# EAGLE schematic Wheel_Test_Signal (EAGLE 9.6.2)
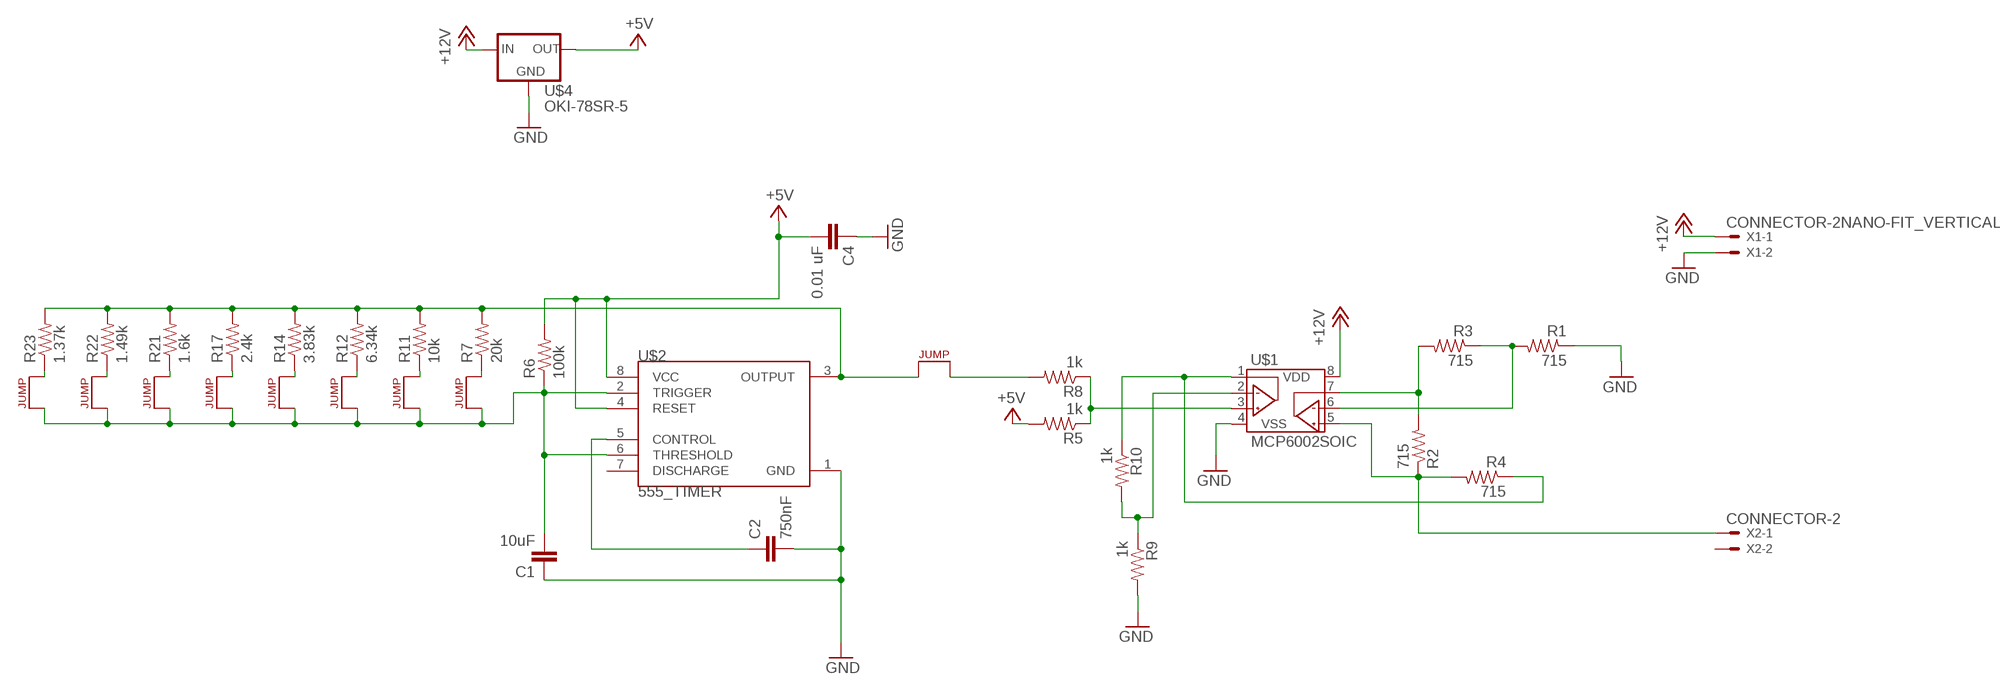
[diagram p0: schematic, sheet 1, part 1 of 2]
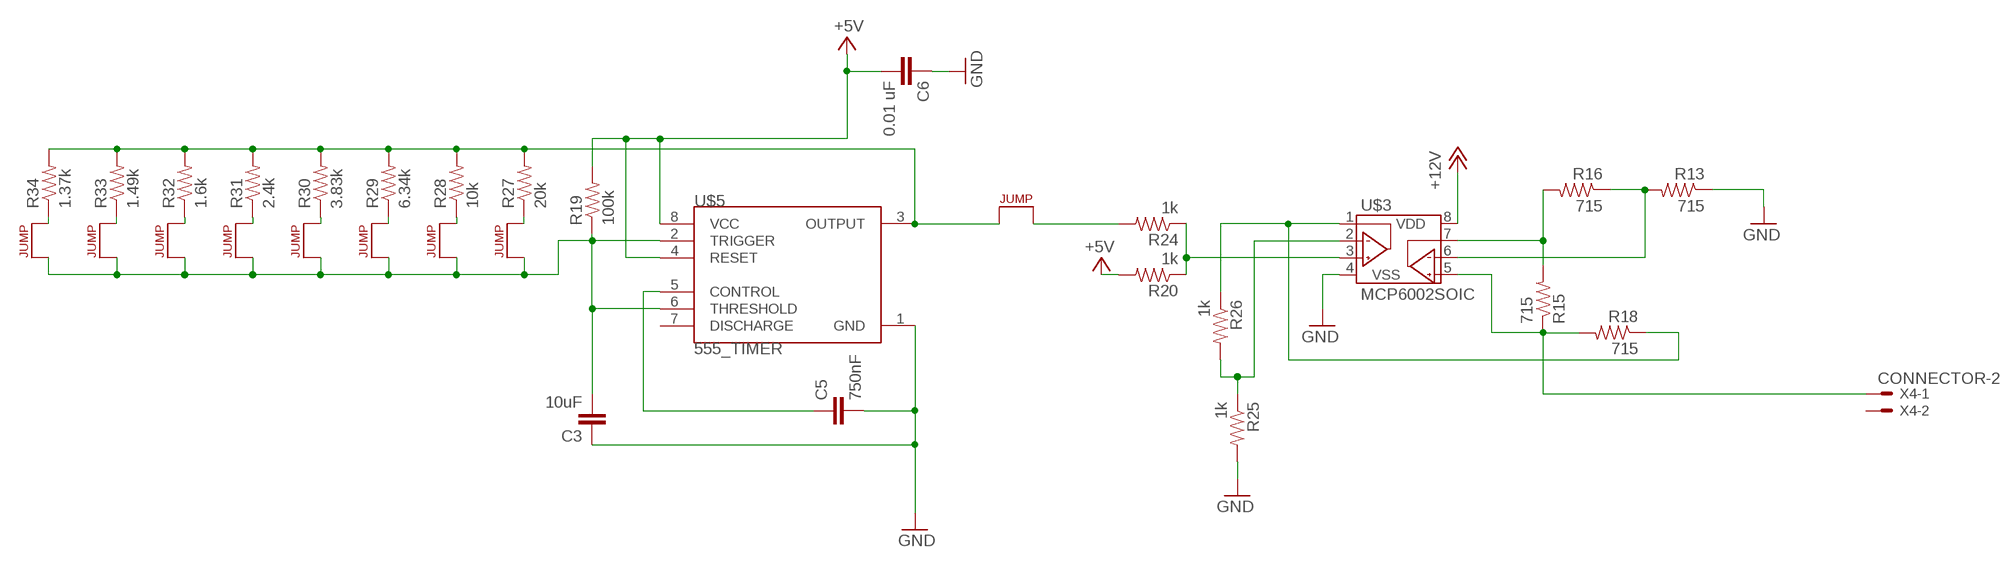
[diagram p1: schematic, sheet 1, part 2 of 2]

## Parts
C1  10uF  CAP0603-CAP  [0603-CAP]
C2  750nF  CAP0603-CAP  [0603-CAP]
C3  10uF  CAP0603-CAP  [0603-CAP]
C4  0.01 uF  CAP0603-CAP  [0603-CAP]
C5  750nF  CAP0603-CAP  [0603-CAP]
C6  0.01 uF  CAP0603-CAP  [0603-CAP]
J1  JUMPER.1  [1X02]
J2  JUMPER.1  [1X02]
J3  JUMPER.1  [1X02]
J4  JUMPER.1  [1X02]
J5  JUMPER.1  [1X02]
J6  JUMPER.1  [1X02]
J7  JUMPER.1  [1X02]
J8  JUMPER.1  [1X02]
J9  JUMPER.1  [1X02]
J10  JUMPER.1  [1X02]
J11  JUMPER.1  [1X02]
J12  JUMPER.1  [1X02]
J13  JUMPER.1  [1X02]
J14  JUMPER.1  [1X02]
J15  JUMPER.1  [1X02]
J16  JUMPER.1  [1X02]
J17  JUMPER.1  [1X02]
J18  JUMPER.1  [1X02]
R1  715  RESISTOR0603  [0603-RES]
R2  715  RESISTOR0603  [0603-RES]
R3  715  RESISTOR0603  [0603-RES]
R4  715  RESISTOR0603  [0603-RES]
R5  1k  RESISTOR0603  [0603-RES]
R6  100k  RESISTOR0603  [0603-RES]
R7  20k  RESISTOR0603  [0603-RES]
R8  1k  RESISTOR0603  [0603-RES]
R9  1k  RESISTOR0603  [0603-RES]
R10  1k  RESISTOR0603  [0603-RES]
R11  10k  RESISTOR0603  [0603-RES]
R12  6.34k  RESISTOR0603  [0603-RES]
R13  715  RESISTOR0603  [0603-RES]
R14  3.83k  RESISTOR0603  [0603-RES]
R15  715  RESISTOR0603  [0603-RES]
R16  715  RESISTOR0603  [0603-RES]
R17  2.4k  RESISTOR0603  [0603-RES]
R18  715  RESISTOR0603  [0603-RES]
R19  100k  RESISTOR0603  [0603-RES]
R20  1k  RESISTOR0603  [0603-RES]
R21  1.6k  RESISTOR0603  [0603-RES]
R22  1.49k  RESISTOR0603  [0603-RES]
R23  1.37k  RESISTOR0603  [0603-RES]
R24  1k  RESISTOR0603  [0603-RES]
R25  1k  RESISTOR0603  [0603-RES]
R26  1k  RESISTOR0603  [0603-RES]
R27  20k  RESISTOR0603  [0603-RES]
R28  10k  RESISTOR0603  [0603-RES]
R29  6.34k  RESISTOR0603  [0603-RES]
R30  3.83k  RESISTOR0603  [0603-RES]
R31  2.4k  RESISTOR0603  [0603-RES]
R32  1.6k  RESISTOR0603  [0603-RES]
R33  1.49k  RESISTOR0603  [0603-RES]
R34  1.37k  RESISTOR0603  [0603-RES]
U$1  MCP6002SOIC  [SOIC-08]
U$2  555_TIMER  [DIL08]
U$3  MCP6002SOIC  [SOIC-08]
U$4  OKI-78SR-5  [OKI-78SR]
U$5  555_TIMER  [DIL08]
X1  CONNECTOR-2NANO-FIT_VERTICAL-2  [NANO-FIT_VERTICAL-2]
X2  CONNECTOR-2  [MINIFIT_5566-2]
X4  CONNECTOR-2  [MINIFIT_5566-2]

## Nets
+5V: C4.2 C6.2 R5.2 R6.2 R19.2 R20.2 U$2.4(RESET) U$2.8(VCC) U$4.3(OUT) U$5.4(RESET) U$5.8(VCC)
+12V: U$1.8(VDD) U$3.8(VDD) U$4.1(IN) X1.P$1
ALTERNATINGVOLTAGE: R4.1 R10.1 U$1.1(VOUTA)
ALTERNATINGVOLTAGE1: R18.1 R26.1 U$3.1(VOUTA)
GND: C1.1 C2.2 C3.1 C4.1 C5.2 C6.1 R1.1 R9.2 R13.1 R25.2 U$1.4(VSS) U$2.1(GND) U$3.4(VSS) U$4.2(GND) U$5.1(GND) X1.P$2
N$1: R2.2 R3.2 U$1.7(VOUTB)
N$2: R1.2 R3.1 U$1.6(VINB-)
N$3: C2.1 U$2.5(CONTROL)
N$4: J2.2 R8.2
N$5: C1.2 J1.1 J3.1 J4.1 J5.1 J6.1 J7.1 J8.1 J9.1 R6.1 U$2.2(TRIGGER) U$2.6(THRESHOLD)
N$6: R5.1 R8.1 U$1.3(VINA+)
N$7: J9.2 R7.1
N$8: J2.1 R7.2 R11.2 R12.2 R14.2 R17.2 R21.2 R22.2 R23.2 U$2.3(OUTPUT)
N$9: R9.1 R10.2 U$1.2(VINA-)
N$10: J8.2 R11.1
N$11: J7.2 R12.1
N$12: J6.2 R14.1
N$13: J5.2 R17.1
N$14: J4.2 R21.1
N$15: J3.2 R22.1
N$16: J1.2 R23.1
N$17: R13.2 R16.1 U$3.6(VINB-)
N$18: J10.1 R27.2 R28.2 R29.2 R30.2 R31.2 R32.2 R33.2 R34.2 U$5.3(OUTPUT)
N$19: R20.1 R24.1 U$3.3(VINA+)
N$20: R15.2 R16.2 U$3.7(VOUTB)
N$21: R25.1 R26.2 U$3.2(VINA-)
N$22: C3.2 J11.1 J12.1 J13.1 J14.1 J15.1 J16.1 J17.1 J18.1 R19.1 U$5.2(TRIGGER) U$5.6(THRESHOLD)
N$23: C5.1 U$5.5(CONTROL)
N$24: J10.2 R24.2
N$25: J18.2 R27.1
N$26: J17.2 R28.1
N$27: J16.2 R29.1
N$28: J15.2 R30.1
N$29: J14.2 R31.1
N$30: J13.2 R32.1
N$31: J12.2 R33.1
N$32: J11.2 R34.1
SENSOROUT: R2.1 R4.2 U$1.5(VINB+) X2.1
SENSOROUT1: R15.1 R18.2 U$3.5(VINB+) X4.1
Unconnected: U$2.7(DISCHARGE) U$5.7(DISCHARGE) X2.2 X4.2

## Library data of the parts
C1-C6 = HyTechDevices:CAP: Capacitor Standard 0603 ceramic capacitor, and 0.1" leaded capacitor.
J1-J18 = HyTechDevices:JUMPER: Jumper for changing operation of a device
R1-R34 = HyTechDevices:RESISTOR: Resistor Basic schematic elements and footprints for 0603, 1206, and PTH resistors.
U$1 U$3 = HyTechDevices:MCP6002: Microchip MCP6002 Dual Channel Op Amp
U$2 U$5 = HyTechDevices:555_TIMER: Standard 555 Timer Fairchild Semiconductor LM555CN Texas Instruments LM555CN/NOPB
U$4 = HyTechDevices:OKI-78SR-5: Murata OKI-78SR 5V 1.5A Non-Isolated Switching Regulator DC/DC - Datasheet <https://power.murata.com/data/power/oki-78sr.pdf>
X1 = HyTechDevices:CONNECTOR-2: Mini-Fit Junior connector 2 pole Source: http://www.molex.com
X2 X4 = HyTechDevices:CONNECTOR-2: Mini-Fit Junior connector 2 pole Source: http://www.molex.com; OC_FARNELL: 1822072; OC_NEWARK: unknown